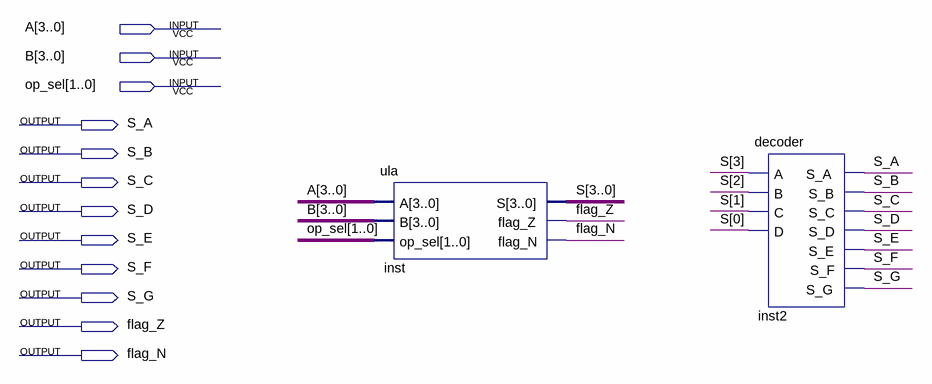
[diagram p0: schematic sheet]
// Quartus schematic display.bdf as structural Verilog: 2 symbols, 12 pins
module display (
  input  [3:0] A,
  input  [3:0] B,
  input  [1:0] op_sel,
  output S_A,
  output S_B,
  output S_C,
  output S_D,
  output S_E,
  output S_F,
  output S_G,
  output flag_Z,
  output flag_N
);

  wire [3:0] S;

  ula inst (.A(A), .B(B), .op_sel(op_sel), .S(S), .flag_Z(flag_Z), .flag_N(flag_N));
  decoder inst2 (
    .A(S[3]), .B(S[2]), .C(S[1]), .D(S[0]), .S_A(S_A), .S_B(S_B), .S_C(S_C), .S_D(S_D), .S_E(S_E), .S_F(S_F),
    .S_G(S_G));
endmodule
